# Altium schematic sheet hv_psu_v100_FRP.SchDoc
size A4; SheetNumber: 1; SheetTotal: 7
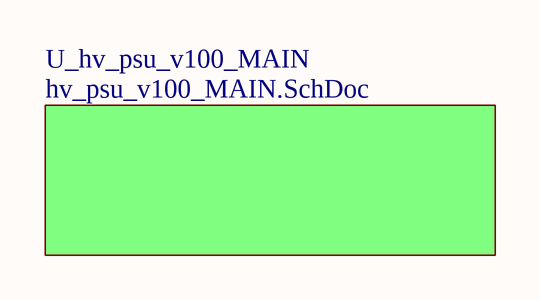
[diagram p0: hv_psu_v100_FRP.SchDoc]

## Sub-sheets
U_hv_psu_v100_MAIN = hv_psu_v100_MAIN.SchDoc: no entries